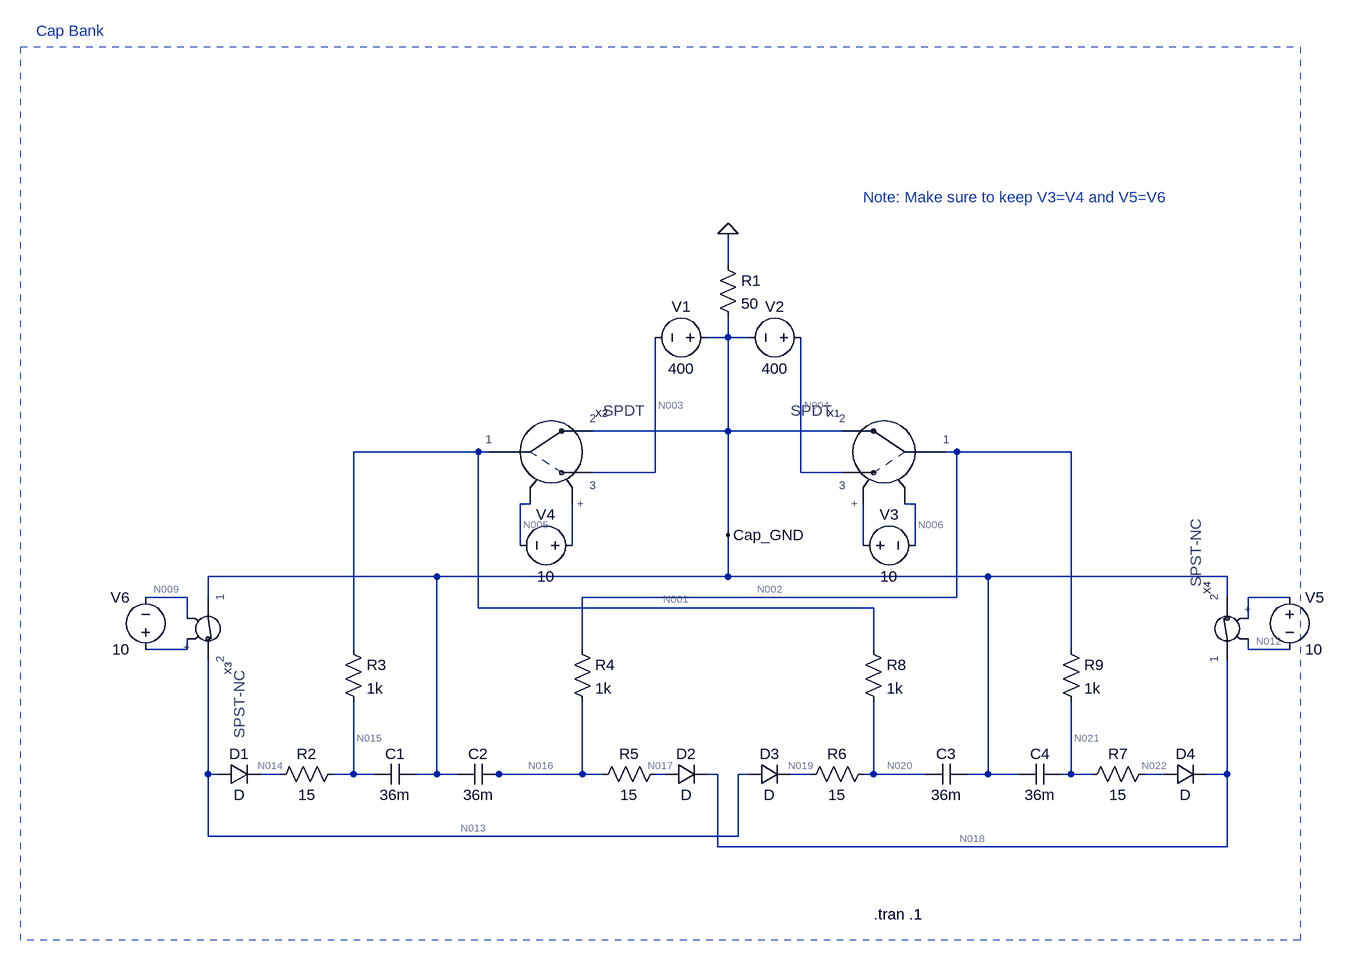
[diagram p0: schematic CUTE_X_Voltage_Circuit.asc]
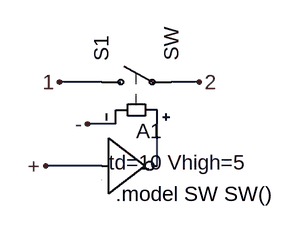
[diagram p1: sub-circuit spst-nc.asc]
CUTE_X_Voltage_Circuit.asc, the LTspice schematic file:
Version 4
SHEET 1 1316 1252
WIRE 208 -16 208 -64
WIRE 208 96 208 64
WIRE 208 96 176 96
WIRE 240 96 208 96
WIRE 208 240 208 96
WIRE 208 240 0 240
WIRE 384 240 208 240
WIRE -176 272 -368 272
WIRE -160 272 -176 272
WIRE 560 272 544 272
WIRE 736 272 560 272
WIRE 96 304 96 96
WIRE 96 304 0 304
WIRE 320 304 320 96
WIRE 384 304 320 304
WIRE -96 352 -112 352
WIRE 496 352 480 352
WIRE 208 400 208 240
WIRE -112 416 -112 352
WIRE -32 416 -32 352
WIRE 416 416 416 352
WIRE 496 416 496 352
WIRE -240 464 -592 464
WIRE 208 464 208 400
WIRE 208 464 -240 464
WIRE 608 464 208 464
WIRE 976 464 608 464
WIRE -624 496 -688 496
WIRE -592 496 -592 464
WIRE 560 496 560 272
WIRE 560 496 -16 496
WIRE 976 496 976 464
WIRE 1072 496 1008 496
WIRE -176 512 -176 272
WIRE 432 512 -176 512
WIRE -624 528 -624 496
WIRE 1008 528 1008 496
WIRE -624 576 -624 560
WIRE -624 576 -688 576
WIRE -368 576 -368 272
WIRE -16 576 -16 496
WIRE 432 576 432 512
WIRE 736 576 736 272
WIRE 1008 576 1008 560
WIRE 1072 576 1008 576
WIRE -592 768 -592 592
WIRE -576 768 -592 768
WIRE -480 768 -512 768
WIRE -368 768 -368 656
WIRE -368 768 -400 768
WIRE -336 768 -368 768
WIRE -240 768 -240 464
WIRE -240 768 -272 768
WIRE -208 768 -240 768
WIRE -144 768 -160 768
WIRE -16 768 -16 656
WIRE -16 768 -144 768
WIRE 16 768 -16 768
WIRE 112 768 96 768
WIRE 192 768 176 768
WIRE 240 768 224 768
WIRE 336 768 304 768
WIRE 432 768 432 656
WIRE 432 768 416 768
WIRE 512 768 432 768
WIRE 608 768 608 464
WIRE 608 768 576 768
WIRE 656 768 608 768
WIRE 736 768 736 656
WIRE 736 768 720 768
WIRE 768 768 736 768
WIRE 880 768 848 768
WIRE 976 768 976 592
WIRE 976 768 944 768
WIRE -592 864 -592 768
WIRE 224 864 224 768
WIRE 224 864 -592 864
WIRE 192 880 192 768
WIRE 976 880 976 768
WIRE 976 880 192 880
FLAG 208 -64 0
FLAG 208 400 Cap_GND
SYMBOL voltage 192 96 R90
WINDOW 0 -32 56 VBottom 2
WINDOW 3 32 56 VTop 2
WINDOW 123 0 0 Left 0
WINDOW 39 0 0 Left 0
SYMATTR InstName V1
SYMATTR Value 400
SYMBOL SPDT 448 272 M0
SYMATTR InstName X1
SYMBOL SPDT -64 272 R0
SYMATTR InstName X2
SYMBOL res 192 -32 R0
SYMATTR InstName R1
SYMATTR Value 50
SYMBOL SPST-NC -592 544 R90
SYMATTR InstName X3
SYMBOL diode -576 784 R270
WINDOW 0 32 32 VTop 2
WINDOW 3 0 32 VBottom 2
SYMATTR InstName D1
SYMBOL res -384 752 R90
WINDOW 0 0 56 VBottom 2
WINDOW 3 32 56 VTop 2
SYMATTR InstName R2
SYMATTR Value 15
SYMBOL cap -272 752 R90
WINDOW 0 0 32 VBottom 2
WINDOW 3 32 32 VTop 2
SYMATTR InstName C1
SYMATTR Value 36m
SYMATTR SpiceLine V=450
SYMBOL cap -144 752 R90
WINDOW 0 0 32 VBottom 2
WINDOW 3 32 32 VTop 2
SYMATTR InstName C2
SYMATTR Value 36m
SYMATTR SpiceLine V=450
SYMBOL res 112 752 R90
WINDOW 0 0 56 VBottom 2
WINDOW 3 32 56 VTop 2
SYMATTR InstName R5
SYMATTR Value 15
SYMBOL diode 112 784 R270
WINDOW 0 32 32 VTop 2
WINDOW 3 0 32 VBottom 2
SYMATTR InstName D2
SYMBOL SPST-NC 976 544 R270
SYMATTR InstName X4
SYMBOL diode 240 784 R270
WINDOW 0 32 32 VTop 2
WINDOW 3 0 32 VBottom 2
SYMATTR InstName D3
SYMBOL res 432 752 R90
WINDOW 0 0 56 VBottom 2
WINDOW 3 32 56 VTop 2
SYMATTR InstName R6
SYMATTR Value 15
SYMBOL cap 576 752 R90
WINDOW 0 0 32 VBottom 2
WINDOW 3 32 32 VTop 2
SYMATTR InstName C3
SYMATTR Value 36m
SYMATTR SpiceLine V=450
SYMBOL cap 720 752 R90
WINDOW 0 0 32 VBottom 2
WINDOW 3 32 32 VTop 2
SYMATTR InstName C4
SYMATTR Value 36m
SYMATTR SpiceLine V=450
SYMBOL res 864 752 R90
WINDOW 0 0 56 VBottom 2
WINDOW 3 32 56 VTop 2
SYMATTR InstName R7
SYMATTR Value 15
SYMBOL diode 880 784 R270
WINDOW 0 32 32 VTop 2
WINDOW 3 0 32 VBottom 2
SYMATTR InstName D4
SYMBOL res -384 560 R0
SYMATTR InstName R3
SYMATTR Value 1k
SYMBOL res -32 560 R0
SYMATTR InstName R4
SYMATTR Value 1k
SYMBOL res 416 560 R0
SYMATTR InstName R8
SYMATTR Value 1k
SYMBOL res 720 560 R0
SYMATTR InstName R9
SYMATTR Value 1k
SYMBOL voltage 400 416 R270
WINDOW 0 32 56 VTop 2
WINDOW 3 -32 56 VBottom 2
WINDOW 123 0 0 Left 0
WINDOW 39 0 0 Left 0
SYMATTR InstName V3
SYMATTR Value 10
SYMBOL voltage -16 416 R90
WINDOW 0 -32 56 VBottom 2
WINDOW 3 32 56 VTop 2
WINDOW 123 0 0 Left 0
WINDOW 39 0 0 Left 0
SYMATTR InstName V4
SYMATTR Value 10
SYMBOL voltage 1072 480 R0
WINDOW 123 0 0 Left 0
WINDOW 39 0 0 Left 0
SYMATTR InstName V5
SYMATTR Value 10
SYMBOL voltage -688 592 R180
WINDOW 0 24 96 Left 2
WINDOW 3 24 16 Left 2
WINDOW 123 0 0 Left 0
WINDOW 39 0 0 Left 0
SYMATTR InstName V6
SYMATTR Value 10
SYMBOL voltage 336 96 R90
WINDOW 0 -32 56 VBottom 2
WINDOW 3 32 56 VTop 2
WINDOW 123 0 0 Left 0
WINDOW 39 0 0 Left 0
SYMATTR InstName V2
SYMATTR Value 400
TEXT -856 -376 Left 2 ;Cap Bank
TEXT 416 -120 Left 2 ;Note: Make sure to keep V3=V4 and V5=V6
TEXT 432 984 Left 2 !.tran .1
RECTANGLE Normal 1088 1024 -880 -352 1

spst-nc.asc, the sub-circuit schematic file:
Version 4
SHEET 1 880 680
WIRE 176 144 128 144
WIRE 288 144 256 144
WIRE 192 192 160 192
WIRE 176 240 112 240
WIRE 240 240 240 192
FLAG 112 240 +
FLAG 160 192 -
FLAG 128 144 1
FLAG 288 144 2
SYMBOL sw 160 144 R270
SYMATTR InstName S1
SYMBOL Digital\\inv 176 176 R0
WINDOW 3 8 60 Left 2
SYMATTR Value td=10 Vhigh=5
SYMATTR InstName A1
TEXT 192 272 Left 2 !.model SW SW()

The netlist it stands for:
* CUTE_X_Voltage_Circuit.asc
V1 Cap_GND N003 400
XX1 N006 N008 N004 Cap_GND N002 SPDT  ; pins - + 3 2 1
XX2 N005 N007 N003 Cap_GND N001 SPDT  ; pins - + 3 2 1
R1 0 Cap_GND 50
XX3 Cap_GND N013 N009 N011 spst-nc
D1 N013 N014 D
R2 N015 N014 15
C1 Cap_GND N015 36m V=450
C2 N016 Cap_GND 36m V=450
R5 N017 N016 15
D2 N017 N018 D
XX4 N018 Cap_GND N012 N010 spst-nc
D3 N013 N019 D
R6 N020 N019 15
C3 Cap_GND N020 36m V=450
C4 N021 Cap_GND 36m V=450
R7 N022 N021 15
D4 N022 N018 D
R3 N001 N015 1k
R4 N002 N016 1k
R8 N001 N020 1k
R9 N002 N021 1k
V3 N008 N006 10
V4 N007 N005 10
V5 N010 N012 10
V6 N011 N009 10
V2 N004 Cap_GND 400

* block symbol definitions
.subckt spst-nc 1 2 - +
S1 1 2 N001 - SW
A1 + 0 0 0 0 N001 0 0 BUF td=10 Vhigh=5
.model SW SW()
.ends spst-nc

.model D D
.lib standard.dio
* Cap Bank
* Note: Make sure to keep V3=V4 and V5=V6
.tran .1
.backanno
.end

* Results of the author's LTspice run, read from the files saved beside the schematic
* Operating Point, zero values left out:
*   V(n003) = -400 V
*   V(n002) = 199.8 V
*   V(n006) = -10 V
*   V(n004) = 400 V
*   V(n001) = -199.8 V
*   V(n005) = -10 V
*   V(n013) = -391.4 mV
*   V(n009) = -10 V
*   V(n014) = -1.183 V
*   V(n015) = -4.118 V
*   V(n016) = 4.118 V
*   V(n017) = 1.183 V
*   V(n018) = 391.4 mV
*   V(n012) = -10 V
*   V(n019) = -1.183 V
*   V(n020) = -4.118 V
*   V(n021) = 4.118 V
*   V(n022) = 1.183 V
*   I(D1) = 195.8 mA
*   I(D2) = 195.8 mA
*   I(D3) = 195.8 mA
*   I(D4) = 195.8 mA
*   I(R2) = -195.7 mA
*   I(R5) = -195.7 mA
*   I(R6) = -195.7 mA
*   I(R7) = -195.7 mA
*   I(R3) = -195.7 mA
*   I(R4) = 195.7 mA
*   I(R8) = -195.7 mA
*   I(R9) = 195.7 mA
*   I(V1) = -200.2 A
*   I(V2) = -200.2 A
*   Ix(x1:3) = 200.2 A
*   Ix(x1:2) = -199.8 A
*   Ix(x1:1) = -391.4 mA
*   Ix(x2:3) = -200.2 A
*   Ix(x2:2) = 199.8 A
*   Ix(x2:1) = 391.4 mA
*   Ix(x3:1) = 391.4 mA
*   Ix(x3:2) = -391.4 mA
*   Ix(x4:1) = 391.4 mA
*   Ix(x4:2) = -391.4 mA
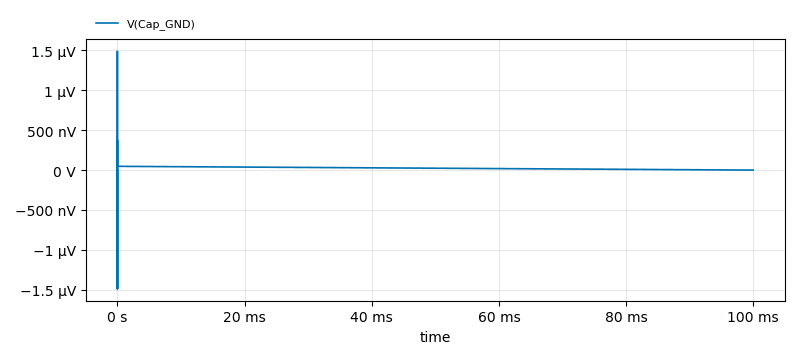
[diagram p2: Transient Analysis of CUTE_X_Voltage_Circuit.asc, plotted from the saved traces]
* Transient Analysis, 1 run:
*   V(Cap_GND): min -1.49 µV, max 1.49 µV, average 22.84 nV, rms 32.64 nV, last 42.58 pV